# EAGLE design 3008_Dálkové (EAGLE 9.2.2)
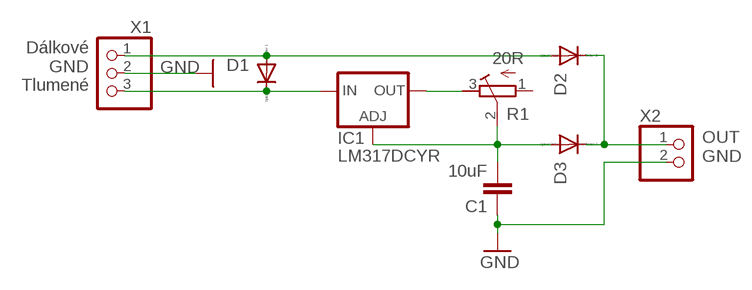
[diagram p0: schematic, sheet 1]

## Parts
C1  10uF  C-EUC1210  [C1210]
D1  DIODE-DO214AA  [DO214AA]
D2  DIODE-DO214AA  [DO214AA]
D3  DIODE-DO214AA  [DO214AA]
IC1  LM317DCYR  LM317MSTT3  [SOT223]
R1  20R  R-TRIMM3362P  [3362P]
X1  PINHD-1X3  [1X03]
X2  PINHD-1X2  [1X02]

## Nets
DALK_IN: D1.A D2.A X1.1
DALK_OUT: D2.C D3.C X2.1
GND: C1.1 X1.2 X2.2
N$2: IC1.2(OUT) IC1.4(OUT) R1.3(E)
REGUL: C1.2 D3.A IC1.1(ADJ) R1.2(S)
TLUM_IN: D1.C IC1.3(IN) X1.3
Unconnected: R1.1(A)

## Notes on the sheet
- Dálkové
  GND
  Tlumené
- OUT
  GND

## Library data of the parts
C1 = resistor:C-EU: CAPACITOR, European symbol
D1-D3 = diode:DIODE-: DIODE
IC1 = Voltage:LM317?*: 500 mA Adjustable Output Positive Voltage Regulator Source: http://www.onsemi.co.jp .. LM317M-D.PDF
R1 = resistor:R-TRIMM: Trimm resistor
X1 = Headery:PINHD-1X3: PIN HEADER
X2 = Headery:PINHD-1X2

## Board
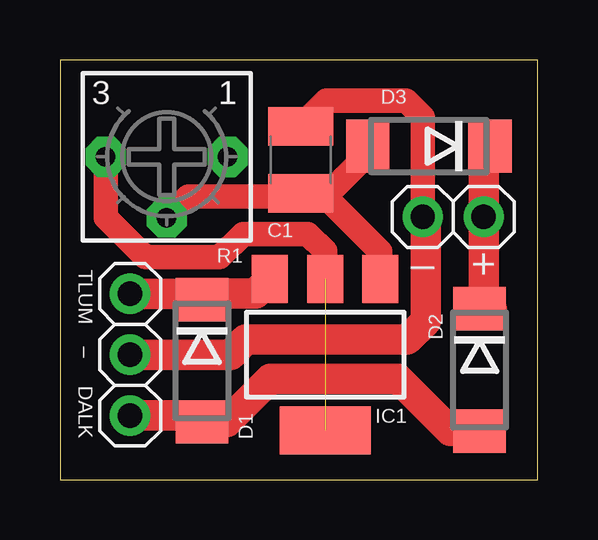
[diagram p1: board, top side]

Size 19.9 x 17.5 mm. Coordinates in mm from the lower left corner, seen from the top.
Outline: 0,0 19.9,0 19.9,17.5 0,17.5 0,0
Copper layers (1*16): Top 0.035mm / dielectric 1.5mm / Bottom 0.035mm
Design rules "default *": minimum track width 6mil, minimum drill 0.35mm, track to track 10mil, track to pad 10mil, pad to pad 10mil, via to via 10mil, smd to smd 10mil, copper to edge 40mil, drill to drill 6mil, minimum pad ring 10mil, minimum via ring 8mil, stop-mask expansion 4mil, vias tented up to drill 0mil, thermal gap 10mil

### Footprints (pad centres in the part's own frame; a part is rotated, then mirrored left to right if it is on the bottom)
C1210 = smd 1.6 x 2.7: 1 -1.4,0; 2 1.4,0
DO214AA = smd 1.8 x 2.2: A 2.55,0; C -2.55,0
SOT223 = smd 1.5 x 2: 1 -2.3,-3.15; 2 0,-3.15; 3 2.3,-3.15 | smd 3.8 x 2: 4 0,3.15
3362P = drill 0.813 pad 1.676 octagon: 1 -2.54,0; 2 0,2.54; 3 2.54,0
1X03 = drill 1.016 pad 1.676: 1 -2.54,0; 2 0,0; 3 2.54,0
1X02 = drill 1.016 pad 1.676: 1 -1.27,0; 2 1.27,0

### Placement (x,y rotation side)
C1  10.03,13.34 270 top
D1  5.92,4.95 270 top
D2  17.48,4.57 270 top
D3  15.37,13.9 180 top
IC1  11.05,5.21 180 top
R1  4.45,13.46 180 top
X1  2.92,5.21 90 top
X2  16.38,10.96 180 top

### Tracks (layer width: path | path; a pad name or v marks a point on that pad's centre or on a via)
DALK_IN
  Top 1.27: X1.1 5.65,2.67 D1.A 6.97,2.4 8.76,4.19 14.1,4.19 16.27,2.02 D2.A
DALK_OUT
  Top 1.27: 17.99,7.12 D2.C 17.65,7.29 X2.1 17.65,13.64 D3.C
GND
  Top 1.016: X2.2 15.11,15.11 14.42,15.8 11.1,15.8 C1.1
  Top 1.27: X1.2 7.11,5.21 7.75,5.84 14.48,5.84 15.24,6.6 15.24,10.83 X2.2
N$2  (1 unrouted)
  Top 1.016: IC1.2 11.05,9.53 10.33,10.25 7.63,10.25 6.66,9.27 3.56,9.27 1.91,10.92 R1.3
REGUL
  Top 1.016: R1.2 5.33,11.81 9.91,11.81 C1.2 | IC1.1 13.35,9.51 10.93,11.94 C1.2 | 12.57,13.9 D3.A 12.82,13.58 11.17,11.94 C1.2
TLUM_IN
  Top 1.27: X1.3 5.67,7.75 D1.C 6.17,7.76 8.15,7.76 IC1.3

### Text on the board
tPlace: TLUM – DALK | – +